# EAGLE schematic Cerebro 4.7 (EAGLE 7.3.0)
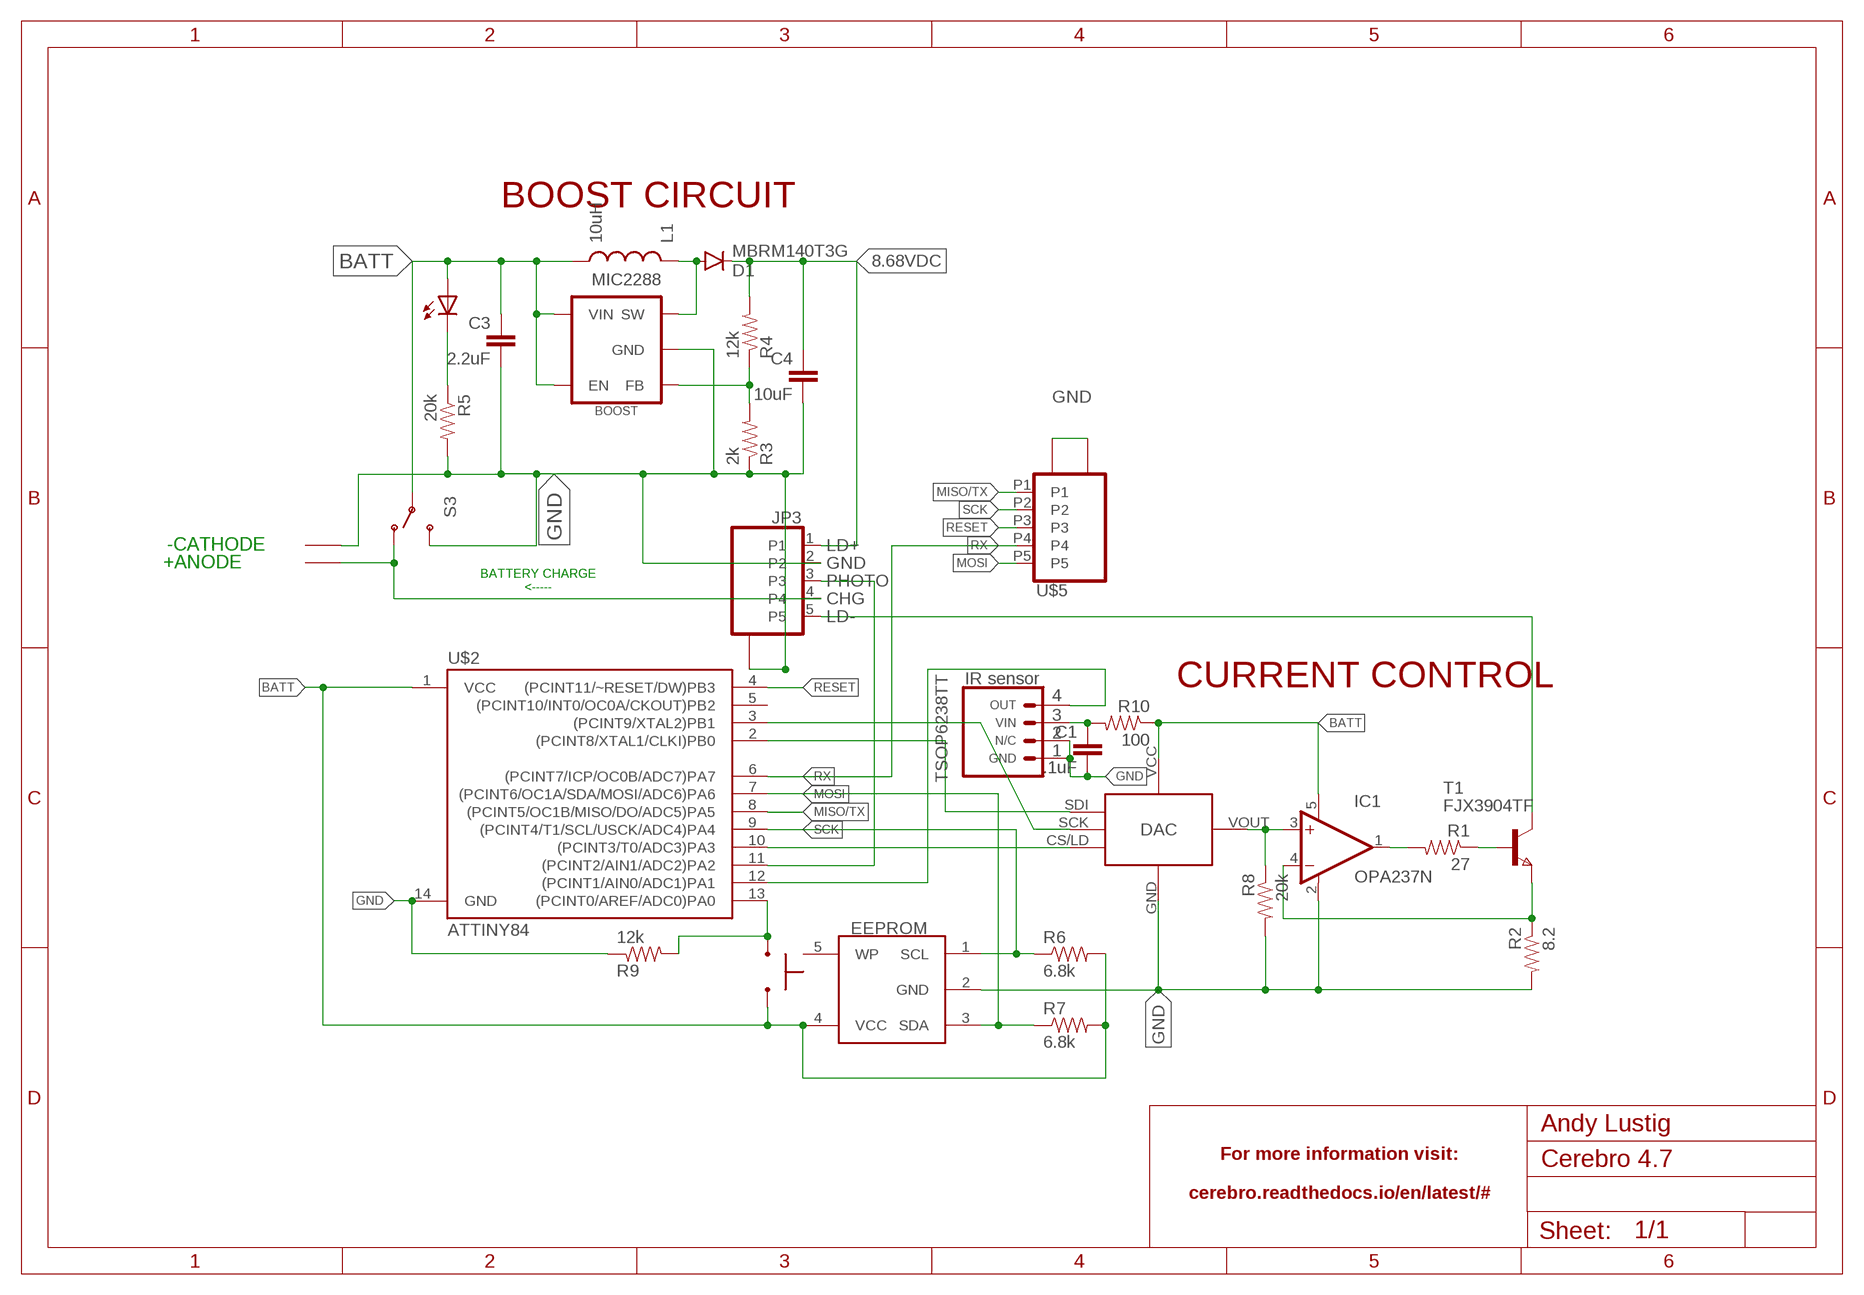
[diagram p0: schematic, sheet 1]

## Parts
C1  .1uF  CAP0603-CAP  [0603-CAP]
C3  2.2uF  CAP0805  [0805]
C4  10uF  CAP0805  [0805]
D1  MBRM140T3G  DIODEPOWERMITE  [POWERMITE]
IC1  OPA237N  [SOT23-5]
INDICATOR_LED  LED  LEDCHIP-LED0603  [CHIP-LED0603]
JP3  USB_MICROB_PLUG-PTH2  [MICRO-B-TH]
L1  10uH  INDUCTORLQH4  [1812]
MIC2288  BOOST  BOOST_CONVERTER  [SOT23-5]
R1  27  RESISTOR0805-RES  [0805]
R2  8.2  RESISTOR0805-RES  [0805]
R3  2k  RESISTOR0805-RES  [0805]
R4  12k  RESISTOR0805-RES  [0805]
R5  20k  RESISTOR0603-RES  [0603-RES]
R6  6.8k  RESISTOR0805-RES  [0805]
R7  6.8k  RESISTOR0805-RES  [0805]
R8  20k  RESISTOR0805-RES  [0805]
R9  12k  RESISTOR0805-RES  [0805]
R10  100  RESISTOR0603-RES  [0603-RES]
S3  SWITCH-SPDTSMD2  [SWITCH-SPDT-SMD]
SDF  TSOP6238TT  [TSOP6]
T1  FJX3904TF  NPNSOT323  [SOT323]
U$1  DAC_LTC2630  [SC-70]
U$2  ATTINY84  [SO14]
U$3  SWITCH-MOMENTARY-NO  [SWITCH_MOMENTARY_XS]
U$4  EEPROM24C64A  [SOT23-5]
U$5  USB_SOCKET_MICRO_VERTHORIZONTAL  [USB_HORZ_MICRO_SMD]
U$7  BATT_TERMINAL  [BATT_TERMINAL]
U$8  BATT_TERMINAL  [BATT_TERMINAL]

## Nets
8.68VDC: C4.1 D1.CATHODE(C) JP3.1 R4.2
BATT: C3.1 IC1.5(V+) INDICATOR_LED.A L1.P$2 L1.P$4 MIC2288.4(EN) MIC2288.5(VIN) R6.2 R7.2 R10.1 S3.2(P) U$1.VCC(VIN) U$2.1(VCC) U$3.P$2 U$4.4(VCC)
GND: C1.2 C3.2 C4.2 IC1.2(V-) JP3.2 JP3.P$1 JP3.P$2 MIC2288.2(GND) R2.2 R3.1 R5.2 R8.2 R9.1 S3.3(S) SDF.P$1 SDF.P$2 U$1.GND U$2.14(GND) U$4.2(GND) U$5.G1 U$5.G2 U$7.P$1
MISO/TX: U$2.8((PCINT5/OC1B/MISO/DO/ADC5)PA5) U$5.P1
MOSI: R7.1 U$2.7((PCINT6/OC1A/SDA/MOSI/ADC6)PA6) U$4.3(SDA) U$5.P5
N$1: SDF.P$4 U$2.12((PCINT1/AIN0/ADC1)PA1)
N$2: U$1.CS/LD U$2.10((PCINT3/T0/ADC3)PA3)
N$3: IC1.3(+IN) R8.1 U$1.VOUT
N$4: JP3.4 S3.1(O) U$8.P$1
N$5: JP3.3 U$2.11((PCINT2/AIN1/ADC2)PA2)
N$6: IC1.4(-IN) R2.1 T1.3(E)
N$7: R9.2 U$2.13((PCINT0/AREF/ADC0)PA0) U$3.P$1
N$8: INDICATOR_LED.C R5.1
N$9: IC1.1(OUT) R1.2
N$10: MIC2288.3(FB) R3.2 R4.1
N$11: R1.1 T1.2(B)
N$12: C1.1 R10.2 SDF.P$3
N$13: JP3.5 T1.1(C)
N$14: U$1.SCK U$2.3((PCINT9/XTAL2)PB1)
N$15: D1.ANODE(A) L1.P$1 L1.P$3 MIC2288.1(SW)
N$16: U$1.SDI U$2.2((PCINT8/XTAL1/CLKI)PB0)
RESET: U$2.4((PCINT11/~RESET/DW)PB3) U$5.P3
RX: U$2.6((PCINT7/ICP/OC0B/ADC7)PA7) U$5.P4
SCK: R6.1 U$2.9((PCINT4/T1/SCL/USCK/ADC4)PA4) U$4.1(SCL) U$5.P2
Unconnected: U$2.5((PCINT10/INT0/OC0A/CKOUT)PB2) U$4.5(WP)

## Notes on the sheet
- BOOST CIRCUIT
- LD+
- -CATHODE
- GND
- +ANODE
- PHOTO
- BATTERY CHARGE
  <-----
- CHG
- LD-
- CURRENT CONTROL

## Library data of the parts
C1 C3 C4 = SparkFun-Capacitors:CAP: Capacitor Standard 0603 ceramic capacitor, and 0.1" leaded capacitor.
D1 = Andy-library:DIODE: Diode These are standard reverse protection diodes and small signal diodes. SMA package can handle up to about 1A. SOD-323 can handle about 200mA. What the SOD-323 package when ordering, there are some mfgs out there that are 5-pin packages.
IC1 = burr-brown:OPA237: Operational Amplifiers Single-Supply, MicroAmplifier(TM) Series; MF: TEXAS INSTRUMENTS; MPN: OPA237NA/250; OC_FARNELL: 4625298; OC_NEWARK: 35C1874
INDICATOR_LED = led:LED: LED OSRAM: - CHIPLED LG R971, LG N971, LY N971, LG Q971, LY Q971, LO R971, LY R971 LH N974, LH R974 LS Q976, LO Q976, LY Q976 LO Q996 - Hyper CHIPLED LW Q18S LB Q993, LB Q99A, LB R99A - SideLED LS A670, LO A670, LY A670, LG A670, LP A670 LB A673, LV A673, LT A673, LW A673 LH A674 LY A675 LS A676, LA A676, LO A676, LY A676, LW A676 LS A679, LY A679, LG A679 - Hyper Micro SIDELED® LS Y876, LA Y876, LO Y876, LY Y876 LT Y87S - SmartLED LW L88C, LW L88S LB L89C, LB L89S, LG L890 LS L89K, LO L89K, LY L89K LS L896, LA L896, LO L896, LY L896 - TOPLED LS T670, LO T670, LY T670, LG T670, LP T670 LSG T670, LSP T670, LSY T670, LOP T670, LYG T670 LG T671, LOG T671, LSG T671 LB T673, LV T673, LT T673, LW T673 LH T674 LS T676, LA T676, LO T676, LY T676, LB T676, LH T676, LSB T676, LW T676 LB T67C, LV T67C, LT T67C, LS T67K, LO T67K, LY T67K, LW E67C LS E67B, LA E67B, LO E67B, LY E67B, LB E67C, LV E67C, LT E67C LW T67C LS T679, LY T679, LG T679 LS T770, LO T770, LY T770, LG T770, LP T770 LB T773, LV T773, LT T773, LW T773 LH T774 LS E675, LA E675, LY E675, LS T675 LS T776, LA T776, LO T776, LY T776, LB T776 LHGB T686 LT T68C, LB T68C - Hyper Mini TOPLED® LB M676 - Mini TOPLED Santana® LG M470 LS M47K, LO M47K, LY M47K Source: http://www.osram.convergy.de LUXEON: - LUMILED® LXK2-PW12-R00, LXK2-PW12-S00, LXK2-PW14-U00, LXK2-PW14-V00 LXK2-PM12-R00, LXK2-PM12-S00, LXK2-PM14-U00 LXK2-PE12-Q00, LXK2-PE12-R00, LXK2-PE12-S00, LXK2-PE14-T00, LXK2-PE14-U00 LXK2-PB12-K00, LXK2-PB12-L00, LXK2-PB12-M00, LXK2-PB14-N00, LXK2-PB14-P00, LXK2-PB14-Q00 LXK2-PR12-L00, LXK2-PR12-M00, LXK2-PR14-Q00, LXK2-PR14-R00 LXK2-PD12-Q00, LXK2-PD12-R00, LXK2-PD12-S00 LXK2-PH12-R00, LXK2-PH12-S00 LXK2-PL12-P00, LXK2-PL12-Q00, LXK2-PL12-R00 Source: www.luxeon.com KINGBRIGHT: KA-3528ASYC Source: www.kingbright.com
JP3 = Andy-library:USB_MICROB_PLUG: USB Micro-B connectors Some male, some female. Watch your step!
L1 = Andy-library:INDUCTOR: Inductors Basic Inductor/Choke - 0603 and 1206. Footprints are not proven and vary greatly between part numbers. SRN6045- 33uH, 20% 1.4A SDR0403-560KL - 56uH, 10%, 500mA RMS/740mA peak
MIC2288 = Andy-library:BOOST_CONVERTER
R1-R10 = Andy-library:RESISTOR: Resistor Basic schematic elements and footprints for 0603, 1206, and PTH resistors.
S3 = Andy-library:SWITCH-SPDT: SPDT Switch slide switch AYZ0102
SDF = Andy-library:TSOP6238TT
T1 = zetex:NPNSOT323: NPN TRANSISTOR; MPN: DSS4160U-7; OC_FARNELL: 1710696; OC_NEWARK: 25R4558
U$1 = Andy-library:DAC_LTC2630
U$2 = SparkFun-DigitalIC:ATTINY84: Atmel 14-pin 2/4/8kB flash uC; PROD_ID: IC-11285
U$3 = Andy-library:SWITCH-MOMENTARY-NO
U$4 = Andy-library:EEPROM
U$5 = Andy-library:USB_SOCKET_MICRO_VERT: horizontal socket. Digikey 609-4616-1-ND
U$7 U$8 = Andy-library:BATT_TERMINAL